# EAGLE design NTC (EAGLE 9.6.2)
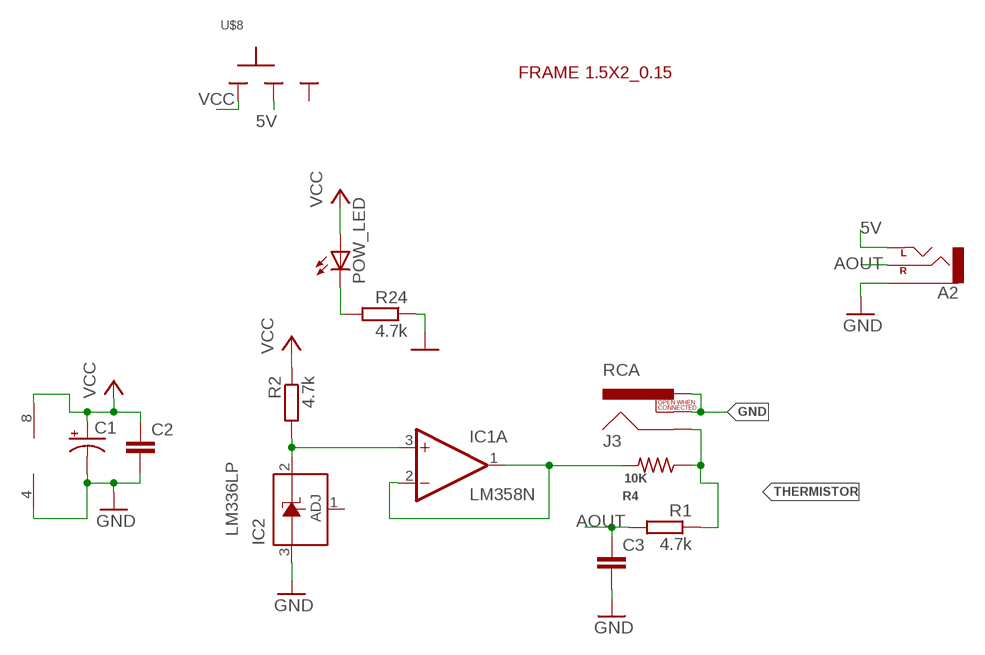
[diagram p0: schematic, sheet 1]

## Parts
A2  AUX-CONNECTOR_CEDT_JANUARY_2015_V5_AUDIO-JACKPTH  [AUX-CONNECTOR_CEDT_JANUARY_2015_V5_AUDIO-JACK]
C1  CAP_POL  [E2,5-5-10U]
C2  C-EU025-024X044  [C025-024X044]
C3  C-EU025-024X044  [C025-024X044]
IC1  LM358N  [DIL08]
IC2  LM336LP  [TO92]
J3  RCA  [RCA]
POW_LED  LED3MM  [LED3MM]
R1  4.7k  R-EU_0204/7  [0204/7]
R2  4.7k  R-EU_0204/7  [0204/7]
R4  10K  R-US_0204/7  [0204/7]
R24  4.7k  R-EU_0204/7  [0204/7]
U$1  FRAME_1.5X2_RAD_0.15  [FRAME_1.5X2_RAD_0.15]
U$8  SLIDESWITCH-BIG  [BIGSWITCH]

## Nets
5V: A2.TIP(LEFT) U$8.2
AOUT: A2.RING(RIGHT) C3.1 R1.2
GND: A2.SLEEVE C1.- C2.2 C3.2 IC1.4(P:V-) IC2.3(A) J3.PIN J3.SWITCH R24.1
N$1: IC1.3(A:+IN) IC2.2(C) R2.2
N$3: IC1.1(A:OUT) IC1.2(A:-IN) R4.2
N$8: POW_LED.K(C) R24.2
THERMISTOR: J3.SHELL R1.1 R4.1
VCC: C1.+ C2.1 IC1.8(P:V+) POW_LED.A R2.1 U$8.1
Unconnected: IC1.5(B:+IN) IC1.6(B:-IN) IC1.7(B:OUT) IC2.1(ADJ) U$8.3

## Library data of the parts
A2 = aux-connector:AUX-CONNECTOR_CEDT_JANUARY_2015_V5_AUDIO-JACK: 3.5mm Audio Jack Simple 3.5mm common PCB mount audio jack. SKU: PRT-08032
C1 = CEDT_2022_v4:CAP_POL
C2 C3 = rcl:C-EU: CAPACITOR, European symbol; SPICEPREFIX: C
IC1 = CEDT_2022_v4:LM358: OP AMP also LM158; LM258; LM2904 Source: http://cache.national.com/ds/LM/LM158.pdf
IC2 = linear:LM336: 2.5-V INTEGRATED REFERENCE CIRCUITS LM236 Source: http://focus.ti.com/lit/ds/symlink/lm336-2.5.pdf
J3 = SparkFun-Connectors:RCA: RCA Jack connector This is a right angle RCA jack connecotr. Commonly used for video or audio. Here is the connector we sell at SparkFun: RCA Jack <https://www.sparkfun.com/products/8631> (PRT-08631) Datasheet <http://www.sparkfun.com/datasheets/Prototyping/Connectors/RCA-Jack.pdf> It is not used on any active designs, however it was used on a couple retired products: RCA Jack Breakout [RETIRED] <https://www.sparkfun.com/products/8826> (PRT-08826) SparkFun On Screen Display Breakout - MAX7456 [RETIRED] <https://www.sparkfun.com/products/9168> (BOB-09168) You may also be interested in a cable: RCA Video Cable - 6' <https://www.sparkfun.com/products/11573> (CAB-11573); PROD_ID: CONN-09081; SF_ID: PRT-08631
POW_LED = CEDT_JANUARY_2015_v6:LED
R1 R2 R24 = rcl:R-EU_: RESISTOR, European symbol; SPICEPREFIX: R
R4 = rcl:R-US_: RESISTOR, American symbol; SPICEPREFIX: R
U$1 = CEDT_JANUARY_2015_v6:FRAME_1.5X2_RAD_0.15
U$8 = CEDT_JANUARY_2015_v6:SLIDESWITCH

## Board
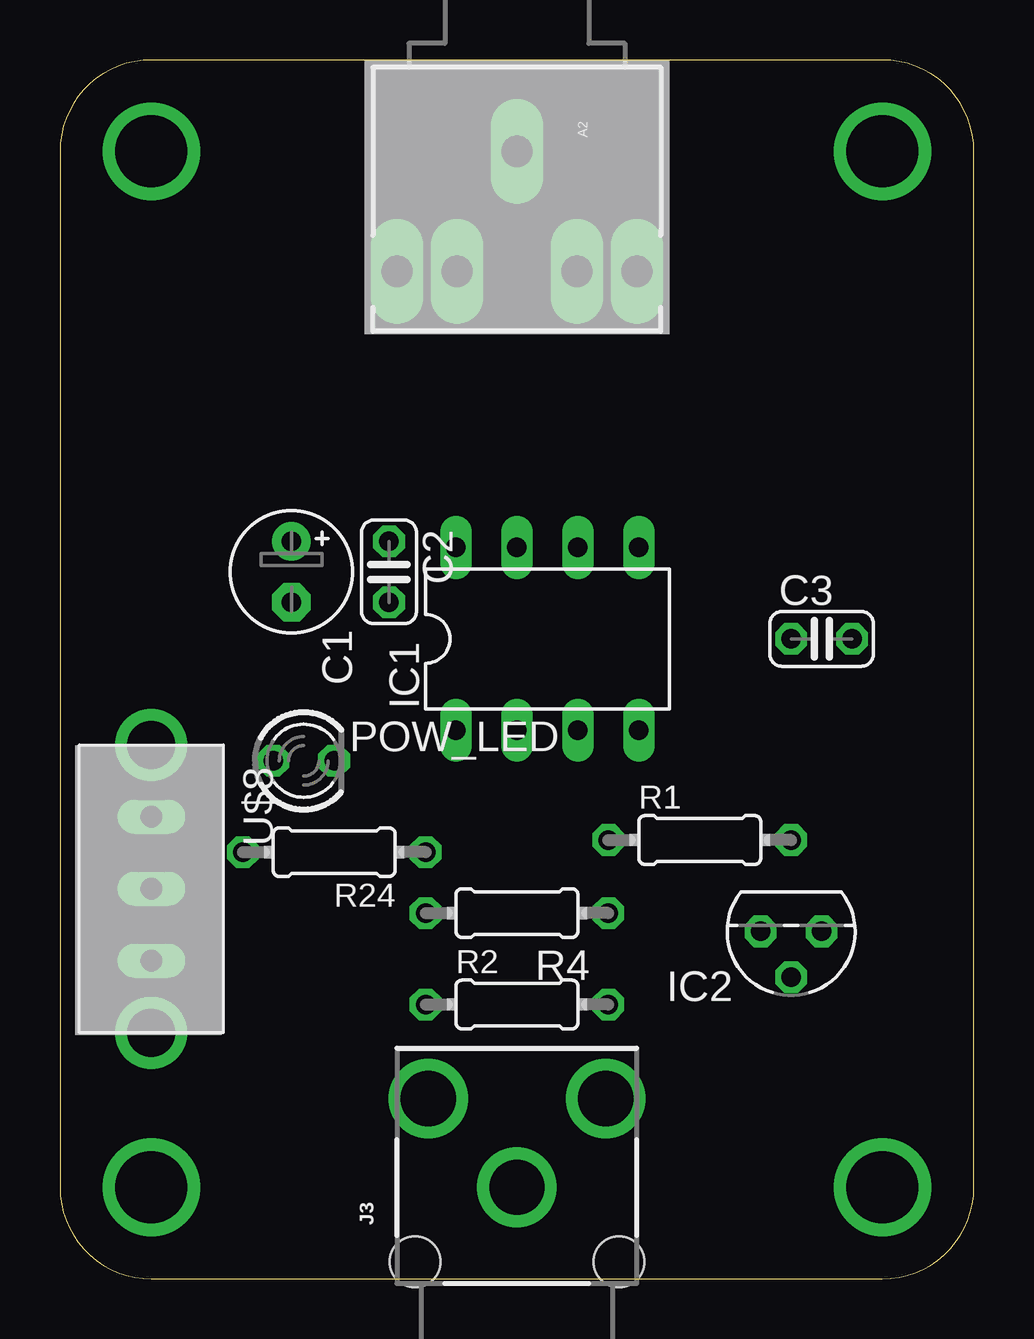
[diagram p1: board, top side]
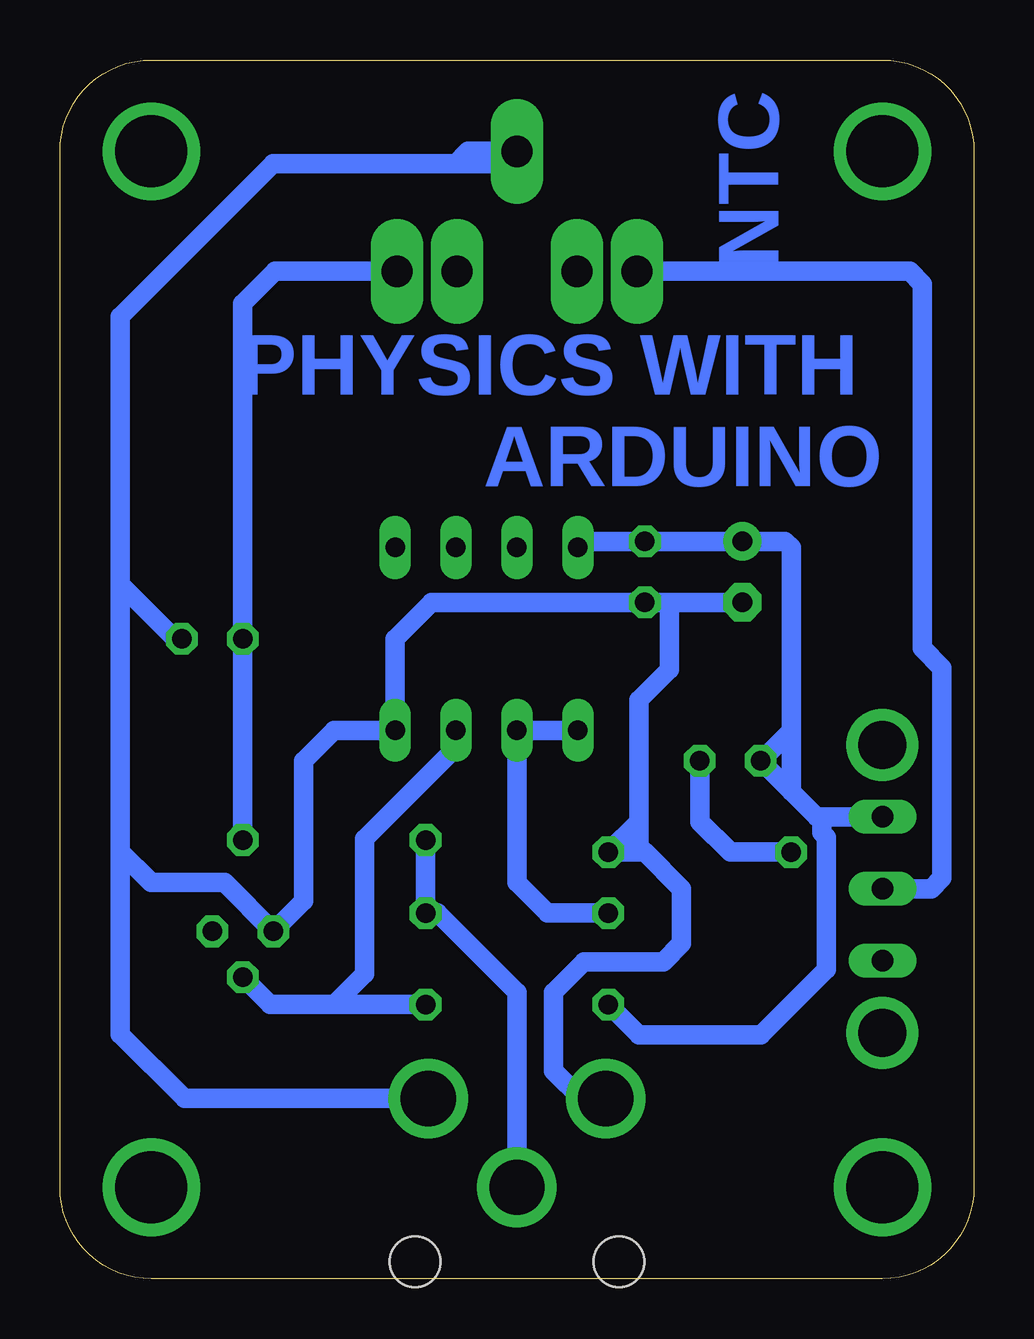
[diagram p2: board, bottom side, seen from below]

Size 38.1 x 50.8 mm. Coordinates in mm from the lower left corner, seen from the top.
Copper layers (1*16): Top 0.035mm / dielectric 1.5mm / Bottom 0.035mm
Design rules "default *": minimum track width 6mil, minimum drill 0.35mm, track to track 16mil, track to pad 16mil, pad to pad 16mil, via to via 16mil, smd to smd 16mil, copper to edge 40mil, drill to drill 6mil, minimum pad ring 10mil, minimum via ring 8mil, stop-mask expansion 4mil, vias tented up to drill 0mil, thermal gap 10mil

### Footprints (pad centres in the part's own frame; a part is rotated, then mirrored left to right if it is on the bottom)
AUX-CONNECTOR_CEDT_JANUARY_2015_V5_AUDIO-JACK = drill 1.3 pad 2.184 long: RING 5,5; RSH 5,2.5; SLEEVE 0,0; TIP 5,-5; TSH 5,-2.5
E2,5-5-10U = drill 0.813 pad 1.6: + -1.27,0 | drill 0.813 pad 1.6 octagon: - 1.27,0
C025-024X044 = drill 0.813 octagon: 1 -1.27,0; 2 1.27,0
DIL08 = drill 0.813 long: 1 -3.81,-3.81; 2 -1.27,-3.81; 3 1.27,-3.81; 4 3.81,-3.81; 5 3.81,3.81; 6 1.27,3.81; 7 -1.27,3.81; 8 -3.81,3.81
TO92 = drill 0.813 octagon: 1 -1.27,0; 2 0,1.905; 3 1.27,0
RCA = drill 2.3: PIN 3.7,3.7; SHELL 0,0; SWITCH 3.7,-3.7 | hole 2.1: -3.1,4.25; -3.1,-4.25
LED3MM = drill 0.813 octagon: A -1.27,0; K 1.27,0
0204/7 = drill 0.813 octagon: 1 -3.81,0; 2 3.81,0
FRAME_1.5X2_RAD_0.15 = drill 2.997 pad 4.064: P$1 3.81,46.99; P$2 34.29,46.99; P$3 34.29,3.81; P$4 3.81,3.81
BIGSWITCH = drill 0.9 long: 1 -3,0; 2 0,0; 3 3,0 | drill 2 pad 2.184: TAB1 -6,0; TAB2 6,0

### Placement (x,y rotation side)
A2  19.05,46.99 270 top
C1  9.65,29.46 270 top
C2  13.72,29.46 270 top
C3  31.75,26.67 0 top
IC1  20.32,26.67 0 top
IC2  30.48,14.48 180 top
J3  19.05,3.81 90 top
POW_LED  10.16,21.59 0 top
R1  26.67,18.29 0 top
R2  19.05,11.43 0 top
R4  19.05,15.24 180 top
R24  11.43,17.78 180 top
U$1  0,0 0 top
U$8  3.81,16.26 270 top

### Tracks (layer width: path | path; a pad name or v marks a point on that pad's centre or on a via)
5V
  Bottom 0.813: U$8.2 1.78,16.26 1.33,16.7 1.33,25.46 2.15,26.28 2.15,41.46 2.68,41.99 A2.TIP
AOUT
  Bottom 0.813: R1.2 C3.1 30.48,40.64 29.13,41.99 A2.RING
GND
  Bottom 0.813: 21.59,46.48 29.21,46.48 35.58,40.11 35.58,28.96 | 21.59,46.48 20.32,46.48 19.05,46.48 | C1.- 12.7,28.19 | 12.7,28.19 C2.2 22.61,28.19 24.13,26.67 IC1.4 26.67,22.86 27.94,21.59 27.94,15.75 IC2.3 31.24,16.51 34.29,16.51 35.58,17.8 | 12.7,28.19 12.7,25.4 13.97,24.13 13.97,19.05 | 13.97,19.05 R24.1 13.72,17.78 | 35.58,28.96 33.29,26.67 C3.2 | 35.58,28.96 35.58,17.8 | 35.58,17.8 35.58,10.18 32.91,7.51 J3.SWITCH | J3.PIN 16.37,7.51 17.53,8.67 17.53,11.94 16.26,13.21 12.95,13.21 12.19,13.97 12.19,16.26 13.72,17.78 | 13.97,19.05 13.97,18.03 13.72,17.78 | A2.SLEEVE 21.08,46.99 21.59,46.48
N$1
  Bottom 0.813: R2.2 26.67,11.43 | 26.67,11.43 29.34,11.43 IC2.2 | IC1.3 21.59,22.15 25.4,18.34 25.4,12.7 26.67,11.43
N$3
  Bottom 0.813: IC1.1 IC1.2 19.05,16.51 17.78,15.24 R4.2
N$8
  Bottom 0.813: POW_LED.K 11.43,19.05 10.16,17.78 R24.2
THERMISTOR
  Bottom 0.813: R1.1 R4.1 22.35,15.24 19.05,11.94 J3.SHELL
VCC
  Bottom 0.813: 7.62,20.32 POW_LED.A 7.62,22.86 | 7.62,20.32 6.56,19.26 6.35,19.26 | 6.35,19.26 U$8.1 | C1.+ C2.1 16.26,30.73 IC1.8 | R2.1 13.97,10.16 8.89,10.16 6.15,12.9 6.15,18.39 6.35,18.59 6.35,19.26 | C1.+ 9.4,30.48 | 7.62,22.86 7.62,30.48 7.87,30.73 C1.+ | 7.62,22.86 7.62,20.32

### Text on the board
Bottom: NTC | PHYSICS WITH / ARDUINO